# Altium schematic sheet JTAG_MCU.SchDoc
size A3
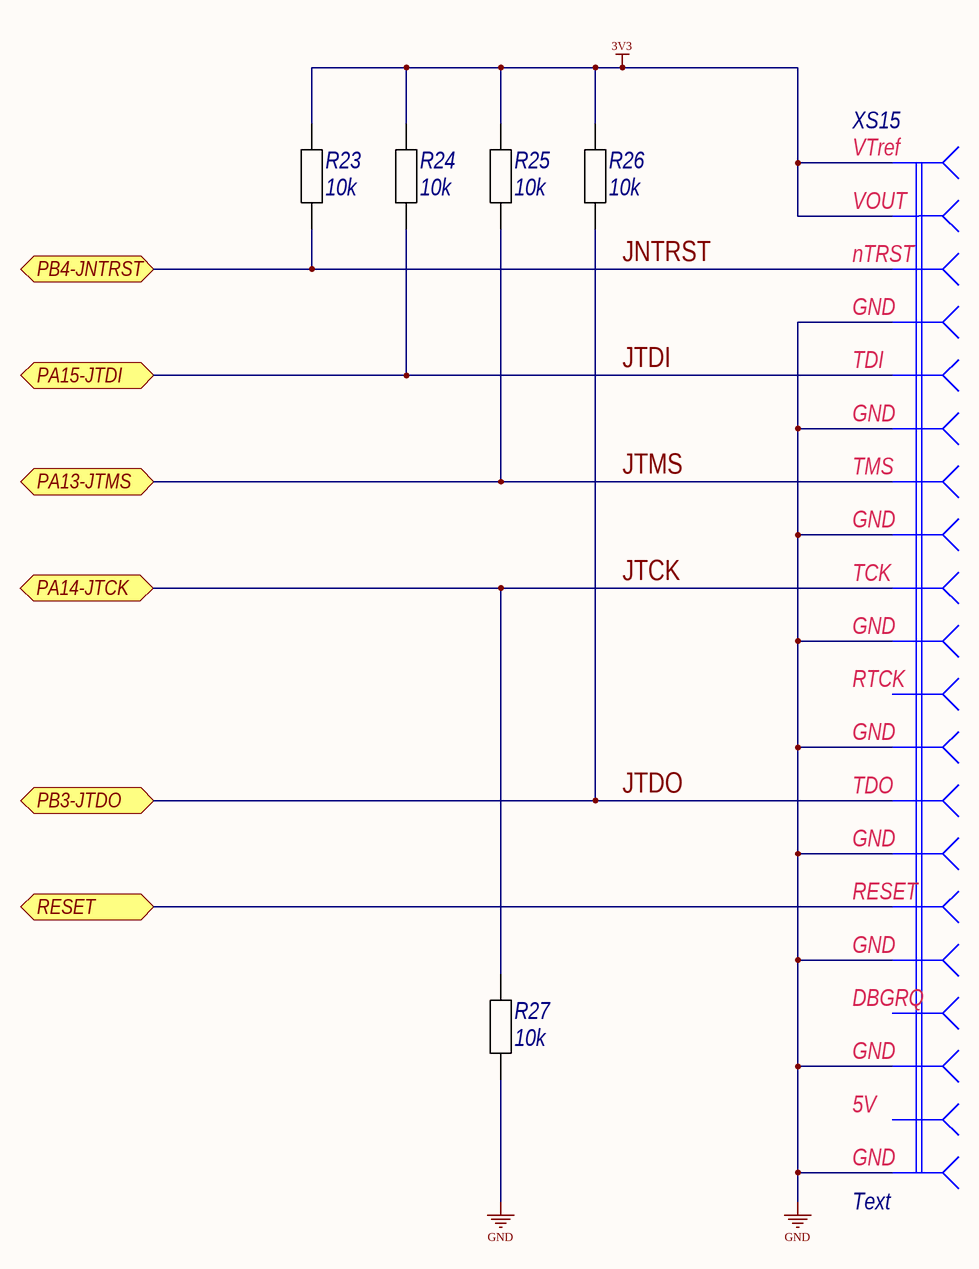
[diagram p0: JTAG_MCU.SchDoc]

## Parts
R23  10k  [C0805R]
R24  10k  [C0805R]
R25  10k  [C0805R]
R26  10k  [C0805R]
R27  10k  [C0805R]
XS15  Text  [IDC-20]

## Ports
PA13-JTMS (bidir), PA14-JTCK (bidir), PA15-JTDI (bidir), PB3-JTDO (bidir), PB4-JNTRST (bidir), RESET (bidir)

## Nets
3V3: R23.2 R24.2 R25.2 R26.2 XS15.1 XS15.2
GND: R27.1 XS15.4 XS15.6 XS15.8 XS15.10 XS15.12 XS15.14 XS15.16 XS15.18 XS15.20
JNTRST: R23.1 XS15.3 ; port PB4-JNTRST
JTCK: R27.2 XS15.9 ; port PA14-JTCK
JTDI: R24.1 XS15.5 ; port PA15-JTDI
JTDO: R26.1 XS15.13 ; port PB3-JTDO
JTMS: R25.1 XS15.7 ; port PA13-JTMS
RESET: XS15.15 ; port RESET

Not connected (* = marked no-connect by the designer): XS15 11 17 19

## Notes on the sheet
- (in symbol JTAG) VTref; VOUT; nTRST; GND; TDI; TMS; TCK; RTCK; TDO; RESET; DBGRQ; 5V

## Library data of the parts
R23-R27 = R0805: Published: 24.03.2010; Publisher: Andrew Danich; Type: Резистор
XS15 = JTAG: Value: Connector; Published: 07.03.2013; Publisher: Andrew Danich; Type: Розетка